# Altium schematic sheet 电压采样方案论证.SchDoc
size A4; SheetNumber: 4; SheetTotal: 4
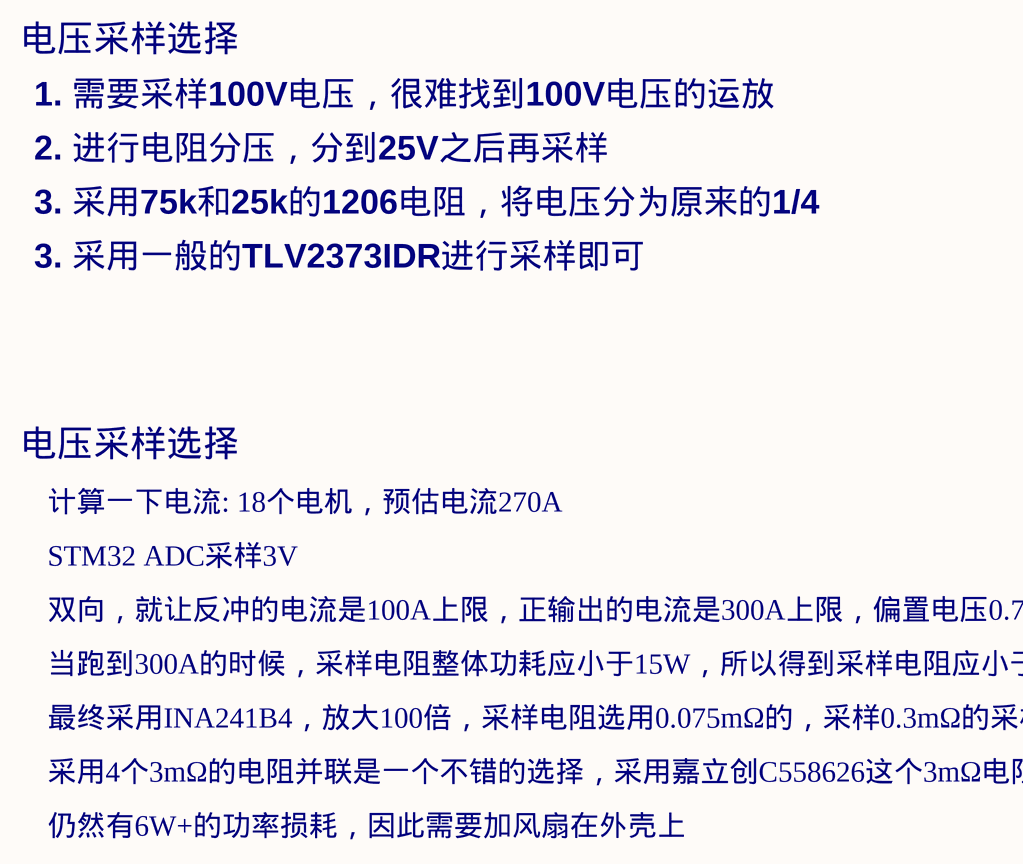
[diagram p0: 电压采样方案论证.SchDoc]

## Notes on the sheet
- 电压采样选择
- 1. 需要采样100V电压，很难找到100V电压的运放
- 2. 进行电阻分压，分到25V之后再采样
- 3. 采用75k和25k的1206电阻，将电压分为原来的1/4
- 3. 采用一般的TLV2373IDR进行采样即可
- 计算一下电流: 18个电机，预估电流270A
- STM32 ADC采样3V
- 双向，就让反冲的电流是100A上限，正输出的电流是300A上限，偏置电压0.75V，STM32对应7.5mV是1A电流
- 当跑到300A的时候，采样电阻整体功耗应小于15W，所以得到采样电阻应小于0.167mΩ，所以放大倍数应大于44倍
- 最终采用INA241B4，放大100倍，采样电阻选用0.075mΩ的，采样0.3mΩ的采样电阻进行并联
- 采用4个3mΩ的电阻并联是一个不错的选择，采用嘉立创C558626这个3mΩ电阻并联4个
- 仍然有6W+的功率损耗，因此需要加风扇在外壳上